# EAGLE schematic MicroMouseV0.0.1 (EAGLE 9.1.0)
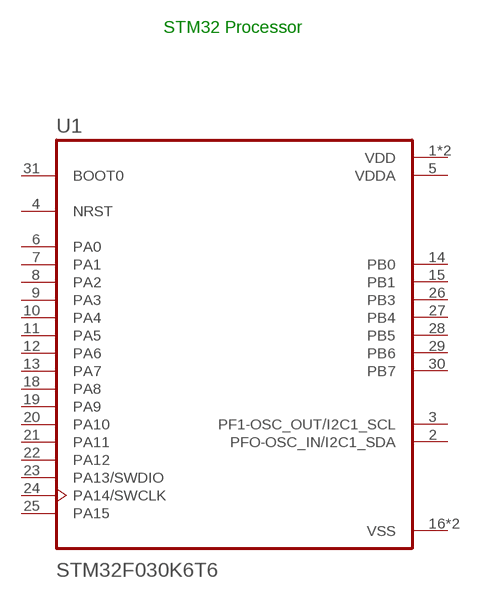
[diagram p0: schematic, sheet 1]

## Parts
U1  STM32F030K6T6  [QFP80P900X900X160-32N]
Unconnected: U1.2(PFO-OSC_IN/I2C1_SDA) U1.3(PF1-OSC_OUT/I2C1_SCL) U1.4(NRST) U1.6(PA0) U1.7(PA1) U1.8(PA2) U1.9(PA3) U1.10(PA4) U1.11(PA5) U1.12(PA6) U1.13(PA7) U1.14(PB0) U1.15(PB1) U1.18(PA8) U1.19(PA9) U1.20(PA10) U1.21(PA11) U1.22(PA12) U1.23(PA13/SWDIO) U1.24(PA14/SWCLK) U1.25(PA15) U1.26(PB3) U1.27(PB4) U1.28(PB5) U1.29(PB6) U1.30(PB7) U1.31(BOOT0)

## Notes on the sheet
- STM32 Processor

## Power pins joined to a net without a drawn wire
VDD: U1.1(VDD) U1.17(VDD)
VDDA: U1.5(VDDA)
VSS: U1.16(VSS) U1.32(VSS)

## Library data of the parts
U1 = STM32F030K6T6:STM32F030K6T6: None; AVAILABILITY: Unavailable; DESCRIPTION: MCU 32-Bit STM32F ARM Cortex M0 RISC 32KB Flash 2.5V/3.3V 32-Pin LQFP Tray; MF: STMicroelectronics; MP: STM32F030K6T6; PACKAGE: LQFP-32 STMicroelectronics; PRICE: None